# Altium schematic sheet sys-part2.SchDoc
size A3; SheetNumber: 2; SheetTotal: 2
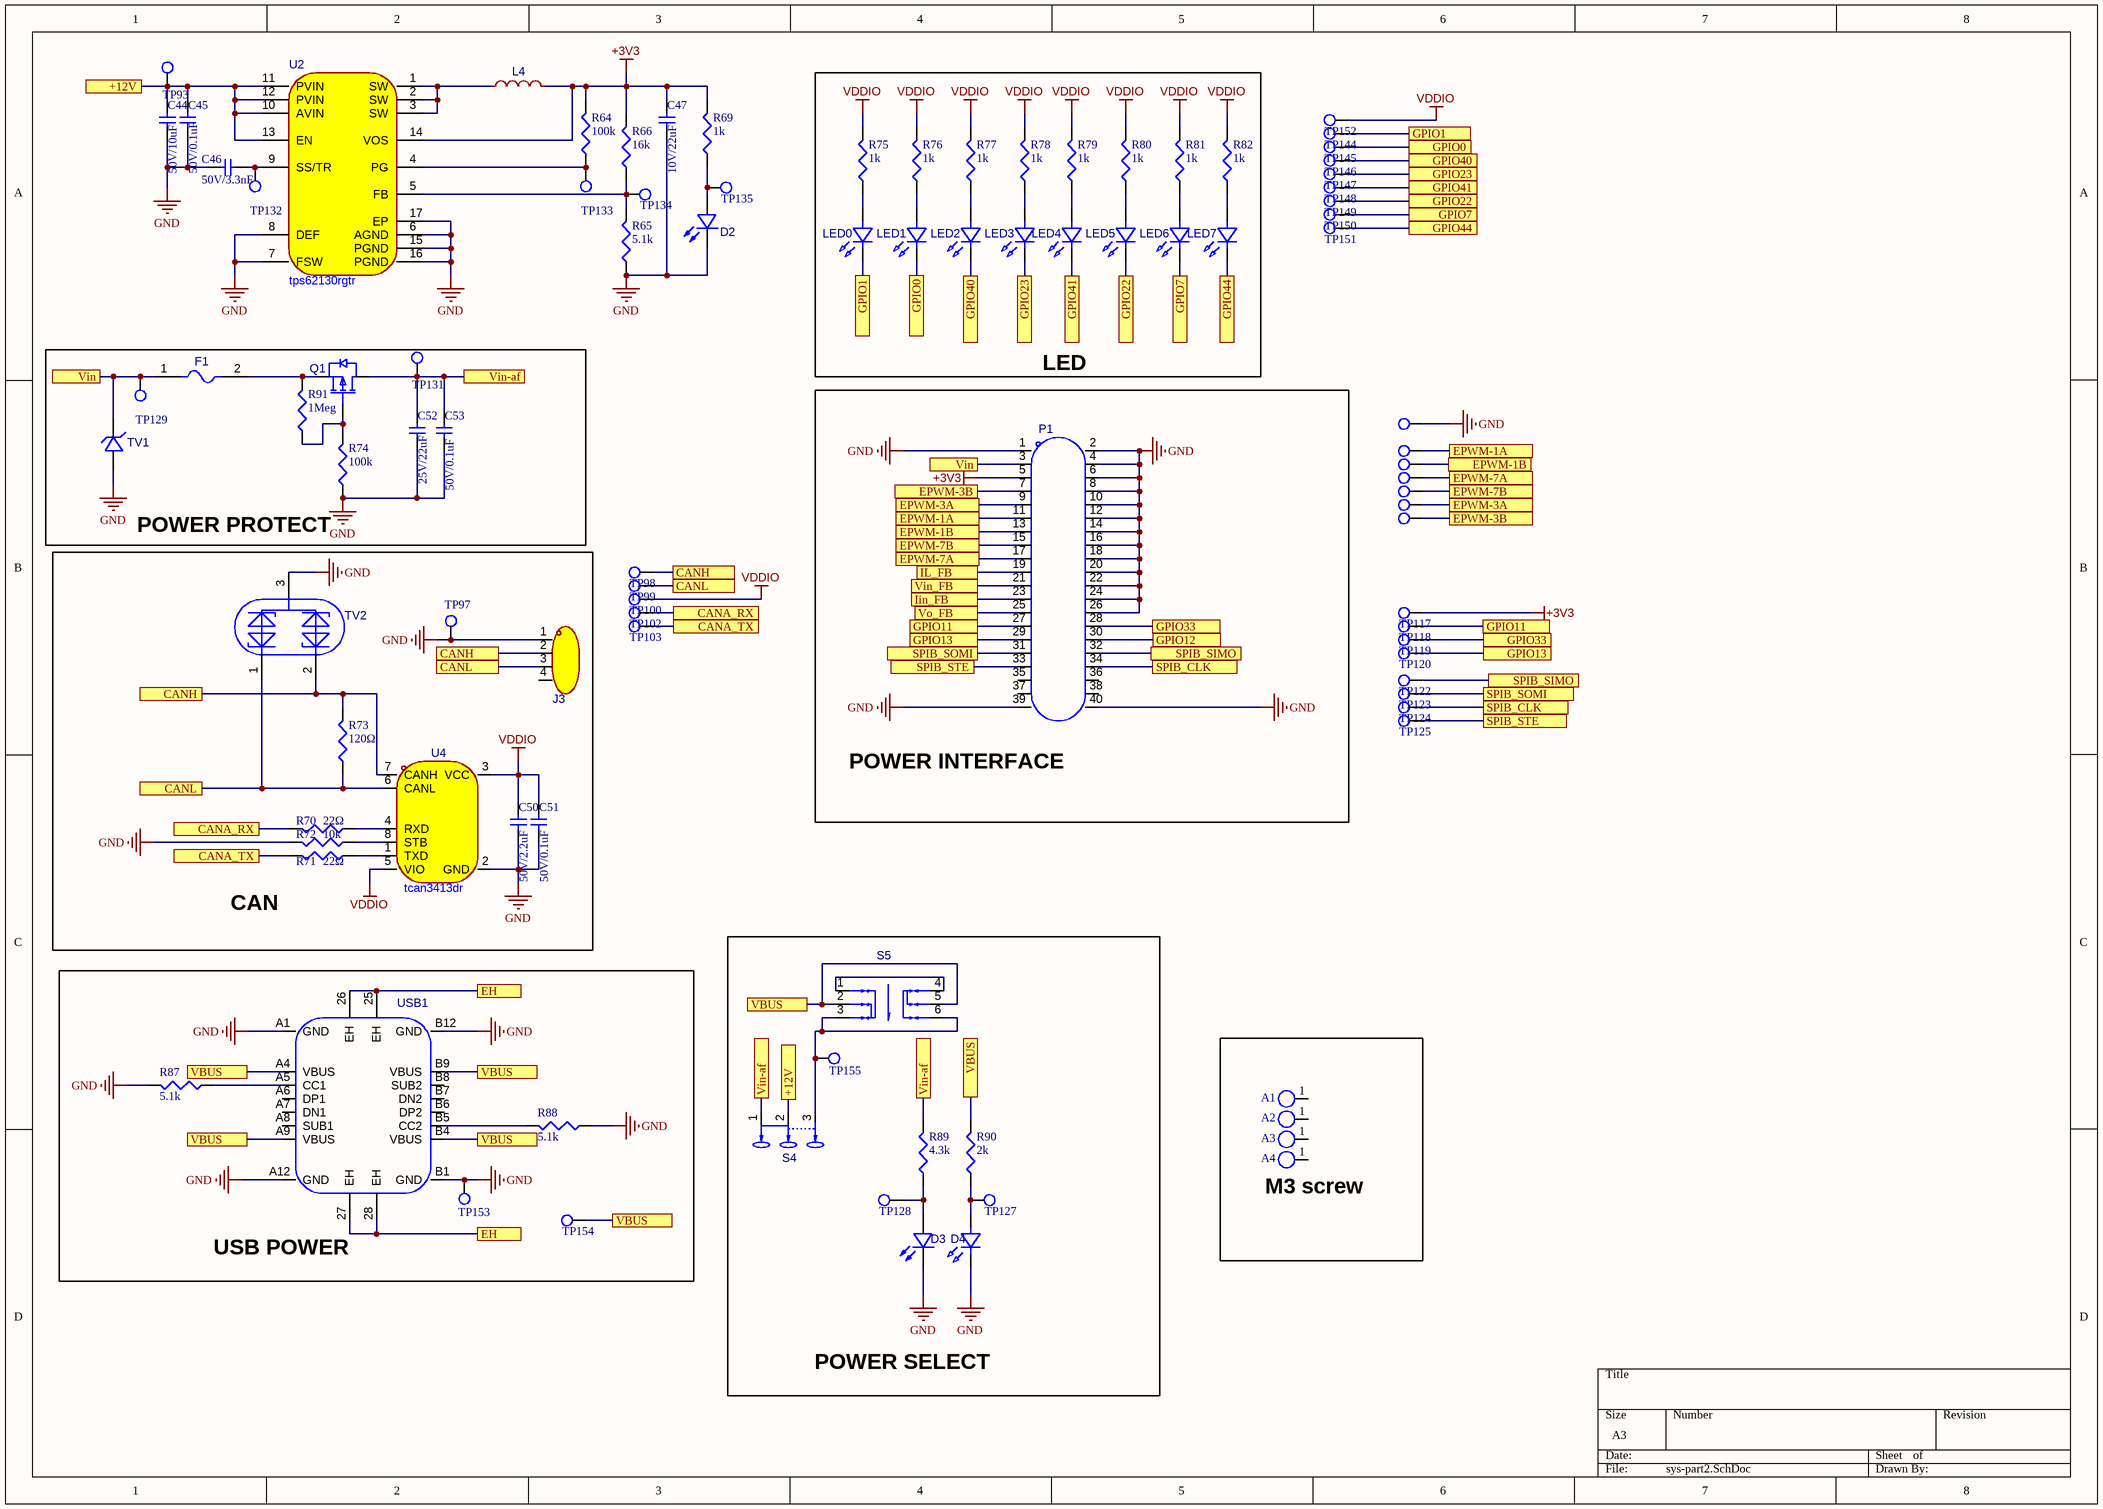
[diagram p0: sys-part2.SchDoc]

## Parts
A1  PAD-3.2/6.0  [PAD-3.2/6.0]  (value not drawn)
A2  PAD-3.2/6.0  [PAD-3.2/6.0]  (value not drawn)
A3  PAD-3.2/6.0  [PAD-3.2/6.0]  (value not drawn)
A4  PAD-3.2/6.0  [PAD-3.2/6.0]  (value not drawn)
C44  50V/10uF  [C0805]
C45  50V/0.1uF  [C0603]
C46  50V/3.3nF  [C0603]
C47  10V/22uF  [C0603]
C50  50V/2.2uF  [C0805]
C51  50V/0.1uF  [C0603]
C52  25V/22uF  [C0805]
C53  50V/0.1uF  [C0603]
D2  ncd0805c1  [LED0805-RD]  (value not drawn)
D3  ncd0805c1  [LED0805-RD]  (value not drawn)
D4  xl-2012surc  [LED0805-RD_RED]  (value not drawn)
F1  nsmd050-24v  [F1206]  (value not drawn)
J3  db125-3.81-4p-gn-s  [CONN-TH_DB125-3.81-4P]  (value not drawn)
L4  fhd4020s-3r3mt  [IND-SMD_L4.0-W4.0]  (value not drawn)
LED0  xl-2012surc  [LED0805-RD_RED]  (value not drawn)
LED1  xl-2012surc  [LED0805-RD_RED]  (value not drawn)
LED2  xl-2012surc  [LED0805-RD_RED]  (value not drawn)
LED3  xl-2012surc  [LED0805-RD_RED]  (value not drawn)
LED4  xl-2012surc  [LED0805-RD_RED]  (value not drawn)
LED5  xl-2012surc  [LED0805-RD_RED]  (value not drawn)
LED6  xl-2012surc  [LED0805-RD_RED]  (value not drawn)
LED7  xl-2012surc  [LED0805-RD_RED]  (value not drawn)
P1  zx-pm2.54-2-20py  [HDR-TH_40P-P2.54-V-F-R2-C20-S2.54]  (value not drawn)
Q1  ao3407a_c15155  [SOT-23-3_L2.9-W1.6-P1.90-LS2.8-BR]  (value not drawn)
R64  100k  [R0603]
R65  5.1k  [R0603]
R66  16k  [R0603]
R69  1k  [R0603]
R70  22Ω  [R0603]
R71  22Ω  [R0603]
R72  10k  [R0603]
R73  120Ω  [R0603]
R74  100k  [R0603]
R75  1k  [R0603]
R76  1k  [R0603]
R77  1k  [R0603]
R78  1k  [R0603]
R79  1k  [R0603]
R80  1k  [R0603]
R81  1k  [R0603]
R82  1k  [R0603]
R87  5.1k  [R0603]
R88  5.1k  [R0603]
R89  4.3k  [R0603]
R90  2k  [R0603]
R91  1Meg  [R0603]
S4  ss-12d10l5  [SW-TH_SS-12D10L5]  (value not drawn)
S5  xkb8080-z  [SW-TH_6P-L8.0-W8.0-P2.50]  (value not drawn)
TP93  TEST POINT  [TP-1.5]  (value not drawn)
TP97  TP-pad0.8  [PAD0.8/1.6]  (value not drawn)
TP98  TEST POINT  [TP-1.5]  (value not drawn)
TP99  TEST POINT  [TP-1.5]  (value not drawn)
TP100  TEST POINT  [TP-1.5]  (value not drawn)
TP102  TEST POINT  [TP-1.5]  (value not drawn)
TP103  TEST POINT  [TP-1.5]  (value not drawn)
TP104  TP-pad0.8  [PAD0.8/1.6]  (value not drawn)
TP105  TP-pad0.8  [PAD0.8/1.6]  (value not drawn)
TP106  TP-pad0.8  [PAD0.8/1.6]  (value not drawn)
TP107  TP-pad0.8  [PAD0.8/1.6]  (value not drawn)
TP108  TP-pad0.8  [PAD0.8/1.6]  (value not drawn)
TP109  TP-pad0.8  [PAD0.8/1.6]  (value not drawn)
TP110  TP-pad0.8  [PAD0.8/1.6]  (value not drawn)
TP117  TEST POINT  [TP-1.5]  (value not drawn)
TP118  TEST POINT  [TP-1.5]  (value not drawn)
TP119  TEST POINT  [TP-1.5]  (value not drawn)
TP120  TEST POINT  [TP-1.5]  (value not drawn)
TP122  TEST POINT  [TP-1.5]  (value not drawn)
TP123  TEST POINT  [TP-1.5]  (value not drawn)
TP124  TEST POINT  [TP-1.5]  (value not drawn)
TP125  TEST POINT  [TP-1.5]  (value not drawn)
TP127  TEST POINT  [TP-1.5]  (value not drawn)
TP128  TEST POINT  [TP-1.5]  (value not drawn)
TP129  TEST POINT  [TP-1.5]  (value not drawn)
TP131  TEST POINT  [TP-1.5]  (value not drawn)
TP132  TEST POINT  [TP-1.5]  (value not drawn)
TP133  TEST POINT  [TP-1.5]  (value not drawn)
TP134  TEST POINT  [TP-1.5]  (value not drawn)
TP135  TEST POINT  [TP-1.5]  (value not drawn)
TP144  TEST POINT  [TP-1.5]  (value not drawn)
TP145  TEST POINT  [TP-1.5]  (value not drawn)
TP146  TEST POINT  [TP-1.5]  (value not drawn)
TP147  TEST POINT  [TP-1.5]  (value not drawn)
TP148  TEST POINT  [TP-1.5]  (value not drawn)
TP149  TEST POINT  [TP-1.5]  (value not drawn)
TP150  TEST POINT  [TP-1.5]  (value not drawn)
TP151  TEST POINT  [TP-1.5]  (value not drawn)
TP152  TEST POINT  [TP-1.5]  (value not drawn)
TP153  TP-pad0.8  [PAD0.8/1.6]  (value not drawn)
TP154  TEST POINT  [TP-1.5]  (value not drawn)
TP155  TP-pad0.8  [PAD0.8/1.6]  (value not drawn)
TV1  smbj15a_c83846  [SMB_L4.6-W3.6-LS5.3-RD]  (value not drawn)
TV2  pesd1can,215  [SOT-23_L2.9-W1.3-P1.90-LS2.4-BR]  (value not drawn)
U2  tps62130rgtr  [QFN-16_L3.0-W3.0-P0.50-TL-EP1.7]
U4  tcan3413dr  [SOP-8_L4.9-W3.9-P1.27-LS6.0-BL-1]
USB1  type-c 16p cb1.6 073  [USB-C-SMD_SHOU_TYPE-C-16P-CB1.6]  (value not drawn)

## Blocks framed on the sheet
LED: LED0-LED7 R75-R82
POWER PROTECT: C52 C53 F1 Q1 R74 R91 TP129 TP131 TV1
POWER INTERFACE: P1
CAN: C50 C51 J3 R70-R73 TP97 TV2 U4
USB POWER: R87 R88 TP153 TP154 USB1
POWER SELECT: D3 D4 R89 R90 S4 S5 TP127 TP128 TP155
M3 screw: A1-A4

## Ports
+12V, CANA_RX, CANA_TX, CANH, CANL, EH, EPWM-1A, EPWM-1B, EPWM-3A, EPWM-3B, EPWM-7A, EPWM-7B, GPIO0, GPIO1, GPIO7, GPIO11, GPIO12, GPIO13, GPIO22, GPIO23, GPIO33, GPIO40, GPIO41, GPIO44, Iin_FB, IL_FB, SPIB_CLK, SPIB_SIMO, SPIB_SOMI, SPIB_STE, VBUS, Vin, Vin-af, Vin_FB, Vo_FB

## Nets
+3V3: C47.1 L4.2 P1.5 R64.2 R66.2 R69.2 TP117.1 U2.14(VOS)
GND: C44.2 C45.2 C46.1 C47.2 C50.2 C51.2 C52.2 C53.2 D2.1(K) D3.1(K) D4.1(K) J3.1 P1.1 P1.2 P1.4 P1.6 P1.8 P1.10 P1.12 P1.14 P1.16 P1.18 P1.20 P1.22 P1.24 P1.26 P1.39 P1.40 R65.1 R72.2 R74.1 R87.2 R88.1 TP97.1 TP104.1 TP153.1 TV1.2 TV2.3 U2.6(AGND) U2.7(FSW) U2.8(DEF) U2.15(PGND) U2.16(PGND) U2.17(EP) U4.2(GND) USB1.A1(GND) USB1.A12(GND) USB1.B1(GND) USB1.B12(GND)
VDDIO: C50.1 C51.1 R75.2 R76.2 R77.2 R78.2 R79.2 R80.2 R81.2 R82.2 TP100.1 TP152.1 U4.3(VCC) U4.5(VIO)
+12V: C44.1 C45.1 S4.2 TP93.1 U2.10(AVIN) U2.11(PVIN) U2.12(PVIN) U2.13(EN) ; port +12V
CANA_RX: R70.2 TP102.1 ; port CANA_RX
CANA_TX: R71.2 TP103.1 ; port CANA_TX
CANH: J3.2 R73.2 TP98.1 TV2.2 U4.7(CANH) ; port CANH
CANL: J3.3 R73.1 TP99.1 TV2.1 U4.6(CANL) ; port CANL
EH: USB1.25(EH) USB1.26(EH) USB1.27(EH) USB1.28(EH) ; port EH
EPWM-1A: P1.11 TP105.1 ; port EPWM-1A
EPWM-1B: P1.13 TP106.1 ; port EPWM-1B
EPWM-3A: P1.9 TP109.1 ; port EPWM-3A
EPWM-3B: P1.7 TP110.1 ; port EPWM-3B
EPWM-7A: P1.17 TP107.1 ; port EPWM-7A
EPWM-7B: P1.15 TP108.1 ; port EPWM-7B
GPIO0: LED1.1(K) TP145.1 ; port GPIO0
GPIO1: LED0.1(K) TP144.1 ; port GPIO1
GPIO7: LED6.1(K) TP150.1 ; port GPIO7
GPIO11: P1.27 TP118.1 ; port GPIO11
GPIO12: P1.30 ; port GPIO12
GPIO13: P1.29 TP120.1 ; port GPIO13
GPIO22: LED5.1(K) TP149.1 ; port GPIO22
GPIO23: LED3.1(K) TP147.1 ; port GPIO23
GPIO33: P1.28 TP119.1 ; port GPIO33
GPIO40: LED2.1(K) TP146.1 ; port GPIO40
GPIO41: LED4.1(K) TP148.1 ; port GPIO41
GPIO44: LED7.1(K) TP151.1 ; port GPIO44
Iin_FB: P1.23 ; port Iin_FB
IL_FB: P1.19 ; port IL_FB
SPIB_CLK: P1.34 TP124.1 ; port SPIB_CLK
SPIB_SIMO: P1.32 TP122.1 ; port SPIB_SIMO
SPIB_SOMI: P1.31 TP123.1 ; port SPIB_SOMI
SPIB_STE: P1.33 TP125.1 ; port SPIB_STE
VBUS: R90.2 S5.2 S5.5 TP154.1 USB1.A4(VBUS) USB1.A9(VBUS) USB1.B4(VBUS) USB1.B9(VBUS) ; port VBUS
Vin: F1.1 P1.3 TP129.1 TV1.1 ; port Vin
Vin-af: C52.1 C53.1 Q1.3(D) R89.2 S4.1 TP131.1 ; port Vin-af
Vin_FB: P1.21 ; port Vin_FB
Vo_FB: P1.25 ; port Vo_FB
NetC46_2: C46.2 TP132.1 U2.9(SS/TR)
NetD2_2: D2.2(A) R69.1 TP135.1
NetD3_2: D3.2(A) R89.1 TP128.1
NetD4_2: D4.2(A) R90.1 TP127.1
NetF1_2: F1.2 Q1.2(S) R91.2
NetL4_1: L4.1 U2.1(SW) U2.2(SW) U2.3(SW)
NetLED0_2: LED0.2(A) R75.1
NetLED1_2: LED1.2(A) R76.1
NetLED2_2: LED2.2(A) R77.1
NetLED3_2: LED3.2(A) R78.1
NetLED4_2: LED4.2(A) R79.1
NetLED5_2: LED5.2(A) R80.1
NetLED6_2: LED6.2(A) R81.1
NetLED7_2: LED7.2(A) R82.1
NetQ1_1: Q1.1(G) R74.2 R91.1
NetR64_1: R64.1 TP133.1 U2.4(PG)
NetR65_2: R65.2 R66.1 TP134.1 U2.5(FB)
NetR70_1: R70.1 U4.4(RXD)
NetR71_1: R71.1 U4.1(TXD)
NetR72_1: R72.1 U4.8(STB)
NetR87_1: R87.1 USB1.A5(CC1)
NetR88_2: R88.2 USB1.B5(CC2)
NetS4_3: S4.3 S5.3 S5.6 TP155.1
NetS5_1: S5.1 S5.4

Not connected (* = marked no-connect by the designer): A1 1; A2 1; A3 1; A4 1; J3 4; P1 35 36 37 38; USB1 A6(DP1) A7(DN1) A8(SUB1) B6(DP2) B7(DN2) B8(SUB2)

## Library data of the parts
C44 = C0805-50V/10uF: 0805,50V/10uF,
C45 C51 C53 = C0603-50V/104: 0603,50V/104
C46 = C0603-50V/3.3nF: 0603,50V/3.3nF
C47 = C0603-10V/22uF: 0603,10V/22uF
C50 = C0805-50V/2.2uF: 0805,50V/2.2uF,
C52 = C0805-25V/22uF: 0805,25V/22uF,
D2 D3 = ncd0805c1: 灯头类型:-;发光颜色:黄绿色;正向压降(Vf):1.6V~2.6V;功率:65mW;正向电流:25mA;波长:565nm~578nm;二极管配置:独立二极管;透镜颜色:-;色温:-;发光强度:55mcd;发光角度:130°;载带方式:-;工作温度:-30℃~+85℃;; Manufacturer: 国星光电; Symbol: FC-2012GHK-570A08; AddInBom: yes; ModelId: b1c5ed7a4f6e46d3bc6f6cc7c20f3fea; ModelTransform: 79.527,49.2125,0,0,0,0,0,0,0; Illumination Color: 黄绿色; Power(Watts): 65mW; Forward Current: 25mA; Peak Wavelength: 576nm; Diode Configuration: 独立二极管; Luminous Intensity: 55mcd; Viewing Angle: 130°; LCSC Part Name: 片式发光二极管; SupplierPart: C84257; ManufacturerPart: NCD0805C1; Supplier Footprint: 0805; JLCPCB Part Class: Extended Part; Datasheet: https://item.szlcsc.com/datasheet/NCD0805C1/85426.html; Supplier: LCSC; ConvertToPcb: yes; FootprintName: LED0805-RD; ModelName: LED0805-RD; Lamp Holder Type: -; Voltage - Forward(Vf): 1.6V~2.6V; Wavelength - Dominant: 565nm~578nm; Lens Color: -; Color Temperature: -; Mounting Style: -; Operating Temperature: -30℃~+85℃
D4 LED0-LED7 = xl-2012surc: 灯头类型:2mmx1.2mm方形灯头;发光颜色:红色;正向压降(Vf):2.3V;功率:50mW;正向电流:20mA;波长:615nm~630nm;二极管配置:独立二极管;透镜颜色:无色透明透镜;色温:-;发光强度:230mcd;发光角度:120°;载带方式:正贴;工作温度:-40℃~+85℃;; Manufacturer: XINGLIGHT(成兴光); AddInBom: yes; ModelId: 9e1095fac56a47ba900124c2261595bd; ModelTransform: 79.527,49.2125,0,0,0,0,0,-0.004,0; Illumination Color: 红色; Voltage - Forward(Vf): 2.3V; Power(Watts): 50mW; Forward Current: 20mA; Peak Wavelength: 620nm; Diode Configuration: 独立二极管; Lens Color: 无色透明透镜; Luminous Intensity: 230mcd; Viewing Angle: 120°; Symbol: XL-2012SURC; LCSC Part Name: 0805红贴片式发光二极管; SupplierPart: C965812; ManufacturerPart: XL-2012SURC; Supplier Footprint: 0805; JLCPCB Part Class: Extended Part; Datasheet: https://item.szlcsc.com/datasheet/XL-2012SURC/1051421.html; Supplier: LCSC; ConvertToPcb: yes; FootprintName: LED0805-RD_RED; ModelName: LED0805-RD_RED; Lamp Holder Type: 2mmx1.2mm方形灯头; Wavelength - Dominant: 615nm~630nm; Color Temperature: -; Mounting Style: 正贴; Operating Temperature: -40℃~+85℃
F1 = nsmd050-24v: 耐压(Vmax):24V;最大电流(Imax):100A;保持电流(Ihold):500mA;跳闸电流(Itrip):1A;; Manufacturer: 台湾陆海; AddInBom: yes; ModelId: f1628daad26847a79b887277a2bc8541; ModelName: F1206_L3.2-W1.7-H0.6; ModelTransform: 125.984,66.929,0,0,0,0,0,0,0; Voltage - Max: 24V; Current - Max: 100A; Hold Current: 500mA; Trip Current: 1A; Power Dissipation: 600mW; Resistance - Initial (Ri) (Min): 150mΩ; Resistance - Post Trip (R1) (Max): 700mΩ; Time to Trip(Max): 100ms; Symbol: nSMD050-24V; LCSC Part Name: 0.50A  24V 自恢复保险丝; SupplierPart: C70076; ManufacturerPart: nSMD050-24V; Supplier Footprint: 1206; JLCPCB Part Class: Extended Part; Datasheet: https://item.szlcsc.com/datasheet/nSMD050-24V/71171.html; Supplier: LCSC; ConvertToPcb: yes; FootprintName: F1206; Length: 3.5mm; Width: 1.8mm; Height: 1.4mm
J3 = db125-3.81-4p-gn-s: 结构:1x4P;间距:3.81mm;颜色:绿色;安装方式:直插;排数:1;每排PIN数:4;额定电流:10A;额定电压:300V;线规 - AWG:16~26;线规 - 平方毫米:1;工作温度:-40℃~+105℃;; Manufacturer: DORABO(地博电气); AddInBom: yes; ModelId: 11e8572fb837469c9a45098d5493725c; ModelName: CONN-TH_DB3.81-LI-4P-125; ModelTransform: 619.6736,291.338,0,180,0,0,11.811,-7.874,-157.48; Number of Positions or Pins: 1x4P; Pitch: 3.81mm; Number of PINs Per Row: 4; Screw Specification: M2; Current Rating: 10A; Voltage Rating (Max): 300V; Wire Gauge - AWG: 16~26; Wire Gauge - mm2: 1; Symbol: DB125-3.81-4P; LCSC Part Name: 1x4P 3.81mm 直插 排数:1 每排P数:4; SupplierPart: C395880; ManufacturerPart: DB125-3.81-4P-GN-S; Supplier Footprint: 插件,P=3.81mm; JLCPCB Part Class: Extended Part; Datasheet: https://item.szlcsc.com/datasheet/DB125-3.81-4P-GN-S/376627.html; Supplier: LCSC; ConvertToPcb: yes; FootprintName: CONN-TH_DB125-3.81-4P; Color: 绿色; Mounting Type: 直插; Number of Pins: 4P; Number of Rows: 1; Operating Temperature: -40℃~+105℃
L4 = fhd4020s-3r3mt: 电感值:3.3uH;精度:±20%;额定电流:4A;饱和电流(Isat):5.9A;类型:绕线电感;; Manufacturer: cjiang(长江微电); AddInBom: yes; ModelId: 45bc3737ecfd4f3bb122605ee525b018; ModelName: IND-SMD_L4.0-W4.0-H1.9; ModelTransform: 157.48,157.484,0,0,0,0,0,0,0; Value: 3.3uH; Tolerance: ±20%; Current Rating: 4A; Current - Saturation(Isat): 5.9A; DC Resistance(DCR): 73mΩ; Type: 绕线电感; Symbol: FHD4020S-3R3MT; LCSC Part Name: 3.3uH ±20% 5.9A; SupplierPart: C602030; ManufacturerPart: FHD4020S-3R3MT; Supplier Footprint: SMD,4x4mm; JLCPCB Part Class: Extended Part; Datasheet: https://atta.szlcsc.com/upload/public/pdf/source/20200609/C601990_BCEA243EC4DA0A9A288AA78A6DFB48A5.pdf; Supplier: LCSC; ConvertToPcb: yes; FootprintName: IND-SMD_L4.0-W4.0
P1 = zx-pm2.54-2-20py: 插孔结构:2x20P;间距:2.54mm;行距:2.54mm;圆孔/方孔:方孔;安装方式:直插;排数:双排;总孔位数:40P;额定电流:3A;额定电压:-;插孔方向:顶部;塑高:8.5mm;触头材质:黄铜;触头镀层:金;工作温度:-40℃~+105℃;; Manufacturer: Megastar(兆星); AddInBom: yes; ModelId: 6c85b3860eb24e43a9d123684eb6d3ee; ModelName: HDR-TH_40P-P2.54-F-LI-2X20P; ModelTransform: 2015.783,196.85,0,0,0,0,0,0,-125.984; Holes Structure: 2x20P; Pitch: 2.54mm; Circular Hole / Square Hole: 方孔; Number of Positions: 40P; Current Rating: 3A; Holes Direction: 顶部; PIN Length: 3.2mm; Symbol: ZX-PM2.54-2-20PY; LCSC Part Name: 2x20P 间距:2.54mm 直插; SupplierPart: C7499354; ManufacturerPart: ZX-PM2.54-2-20PY; Supplier Footprint: 插件,P=2.54mm; JLCPCB Part Class: Extended Part; Datasheet: https://item.szlcsc.com/datasheet/ZX-PM2.54-2-20PY/8574015.html; Supplier: LCSC; ConvertToPcb: yes; FootprintName: HDR-TH_40P-P2.54-V-F-R2-C20-S2.54; Row Spacing: 2.54mm; Mounting Type: 直插; Number of Rows: 双排; Voltage Rating (Max): -; Insulation Height: 8.5mm; Contact Material: 黄铜; Contact Plating: 金; Operating Temperature: -40℃~+105℃
Q1 = ao3407a_c15155: 数量:1个P沟道;漏源电压(Vdss):30V;连续漏极电流(Id):4.3A;导通电阻(RDS(on)):48mΩ@10V;耗散功率(Pd):-;阈值电压(Vgs(th)):2.5V@250uA;; Manufacturer: AOS; AddInBom: yes; ModelId: 89cb27a44ab2466697082bb9fd73a7d0; ModelName: SOT-23-3L_L2.9-W1.6-H1.1-LS2.8-P0.95; ModelTransform: 114.173,110.236,0,90,0,0,0,0,0; Number: 1个P沟道; Drain to Source Voltage: 30V; Current - Continuous Drain(Id): 4.3A; Gate Charge(Qg): 16nC@10V; Input Capacitance(Ciss): 830pF; Reverse Transfer Capacitance (Crss@Vds): 92pF@15V; Symbol: AO3407A; LCSC Part Name: 1个P沟道 耐压:30V 电流:4.3A; SupplierPart: C15155; ManufacturerPart: AO3407A; Supplier Footprint: SOT-23; JLCPCB Part Class: Extended Part; Datasheet: https://item.szlcsc.com/datasheet/AO3407A/15829.html; Supplier: LCSC; ConvertToPcb: yes; FootprintName: SOT-23-3_L2.9-W1.6-P1.90-LS2.8-BR; RDS(on): 48mΩ@10V; Pd - Power Dissipation: -; Gate Threshold Voltage (Vgs(th)): 2.5V@250uA; Operating Temperature: -; Configuration: -; Type: -; Output Capacitance(Coss): -
R64 R74 = R0603-100k: 0603,100k
R65 R87 R88 = R0603-5.1k: 0603,5.1k
R66 = R0603-16k: 0603,16k
R69 R75-R82 = R0603-1k: 0603,1k
R70 R71 = R0603-22Ω: 0603,22Ω
R72 = R0603-10k: 0603,10k
R73 = R0603-120Ω: 0603,120Ω
R89 = R0603-4.3k: 0603,4.3k
R90 = R0603-2k: 0603,2k
R91 = R0603-1Meg: 0603,1Meg
S4 = ss-12d10l5: 电路结构:单刀双掷;安装方式:直插;开关颜色:黑色;额定电流:3A;额定电压:125V;工作寿命:1万次;; Manufacturer: XKB Connection(中国星坤); AddInBom: yes; ModelId: c49f07a32c154ec8ad7cf47670a53981; ModelName: SW-TH_L13.0-W6.8-H6.4-P4.7; ModelTransform: 511.81394,267.716,0,0,0,0,0,0,-220.472; Circuit: 单刀双掷; Actuator Style: 矩形柱状; Switch Height: 6.4mm; Actuator Color: 黑色; Current Rating: 3A; Voltage Rating: 125V; Life: 1万次; Symbol: SS-12D10L5; LCSC Part Name: 柄长5mm 直插双档 滑动开关; SupplierPart: C319012; ManufacturerPart: SS-12D10L5; Supplier Footprint: 插件,13x6.8mm; JLCPCB Part Class: Extended Part; Datasheet: https://item.szlcsc.com/datasheet/SS-12D10L5/300104.html; Supplier: LCSC; ConvertToPcb: yes; FootprintName: SW-TH_SS-12D10L5; Termination Style: PC引脚; Length: 13mm; Width: 6.8mm; Mounting Type: 直插; Operating Temperature: -40℃~+85℃
S5 = xkb8080-z: 自锁/无锁:自锁;安装方式:直插;触点电流:100mA;额定电压:30V;带灯:不带;作用力:1.6N;工作寿命:10万次;; Manufacturer: XKB Connection(中国星坤); AddInBom: yes; ModelId: 2ca63b555ed647238a13c4f5c2920312; ModelName: SW-TH_L8.0-W8.0-H13.7-P2.5; ModelTransform: 314.96,314.96,0,90,0,0,0,0,-125.984; Self Lock / No Lock: 自锁; Actuator Style: 矩形按钮; Contact Current: 100mA; Voltage Rating: 30V; Actuator/Cap Color: 蓝色; With Lamp: 不带; Operating Force: 1.6N; Life: 10万次; Symbol: XKB8080-Z; LCSC Part Name: 8*8 蓝白黑 自锁开关; SupplierPart: C318860; ManufacturerPart: XKB8080-Z; Supplier Footprint: 插件; JLCPCB Part Class: Extended Part; Datasheet: https://item.szlcsc.com/datasheet/XKB8080-Z/299952.html; Supplier: LCSC; ConvertToPcb: yes; FootprintName: SW-TH_6P-L8.0-W8.0-P2.50; IP Rating: -; Mounting Type: 直插; Termination Style: PC引脚; Operating Temperature: -15℃~+55℃
TV1 = smbj15a_c83846: 极性:单向;反向截止电压(Vrwm):15V;钳位电压:24.4V;峰值脉冲电流(Ipp):24.6A;峰值脉冲功率(Ppp):600W;击穿电压(VBR):16.7V;; Manufacturer: Littelfuse(美国力特); AddInBom: yes; ModelId: 5e8926c661484ff2a35b83e5ae62aeb9; ModelTransform: 212.598,141.732,0,0,0,0,0,0,0; Polarity: 单向; Reverse Stand-Off Voltage (Vrwm): 15V; Clamping Voltage: 24.4V; Peak Pulse Current (Ipp): 24.6A; Peak Pulse Power Dissipation (Ppp): 600W; Voltage - Breakdown: 16.7V; Reverse Leakage Current (Ir): 1uA; level of protection: IEC 61000-4-4；IEC 61000-4-2; Symbol: SMBJ15A_C83846; LCSC Part Name: 单向TVS 15V截止 峰值浪涌电流：24.6A; SupplierPart: C83846; ManufacturerPart: SMBJ15A; Supplier Footprint: DO-214AA; JLCPCB Part Class: Extended Part; Datasheet: https://item.szlcsc.com/datasheet/SMBJ15A/85013.html; Supplier: LCSC; ConvertToPcb: yes; FootprintName: SMB_L4.6-W3.6-LS5.3-RD; ModelName: SMB_L4.6-W3.6-LS5.3-RD; Operating Temperature: -65℃~+150℃; Type: TVS
TV2 = pesd1can,215: 极性:双向;反向截止电压(Vrwm):24V;钳位电压:70V;峰值脉冲电流(Ipp):3A@8/20us;峰值脉冲功率(Ppp):200W@8/20us;击穿电压(VBR):27.8V;; Manufacturer: Nexperia(安世); AddInBom: yes; ModelId: c62791f0466c4ae2a892c056b845b0ca; ModelName: SOT-23-3P_L2.9-W1.3-H1.0-LS2.4-P0.95; ModelTransform: 98.64468,114.173,0,180,0,0,0.001,-0.002,0; Polarity: 双向; Reverse Stand-Off Voltage (Vrwm): 24V; Clamping Voltage: 70V; Voltage - Breakdown: 27.8V; Reverse Leakage Current (Ir): 1nA; Number of Channels: 双路; level of protection: IEC 61000-4-5；IEC 61000-4-2; Junction Capacitance: 11pF; Symbol: PESD1CAN,215; LCSC Part Name: 双向ESD 24V截止 峰值脉冲电流：3A@8/20us; SupplierPart: C15771; ManufacturerPart: PESD1CAN,215; Supplier Footprint: SOT-23; JLCPCB Part Class: Extended Part; Datasheet: https://item.szlcsc.com/datasheet/PESD1CAN%252C215/16453.html; Supplier: LCSC; ConvertToPcb: yes; FootprintName: SOT-23_L2.9-W1.3-P1.90-LS2.4-BR; Peak Pulse Current (Ipp): 3A@8/20us; Peak Pulse Power Dissipation (Ppp): 200W@8/20us; Operating Temperature: -65℃~+150℃; Type: ESD
U2 = tps62130rgtr: 功能类型:降压型;工作电压:3V~17V;输出电压:900mV~6V;输出电流:3A;输出类型:可调;; Manufacturer: TI(德州仪器); AddInBom: yes; ModelId: 4b11d3b5aea64910b85c54184b64922e; ModelName: QFN-16_L3.0-W3.0-P0.50-EP1.7; ModelTransform: 118.8974,118.8974,0,0,0,0,0,0,0; Function: 降压型; Voltage - Supply: 3V~17V; Output Current: 3A; Frequency - Switching: 2.5MHz; Synchronous Rectifier: 是; Number of Outputs: 1; Topology: 降压式; Quiescent Current: 17uA; Switch tube (built-in/external): 内置; Output Type: 可调; Symbol: TPS62130RGTR; LCSC Part Name: 降压型 3A 3V~17V; SupplierPart: C43590; ManufacturerPart: TPS62130RGTR; Supplier Footprint: QFN-16-EP(3x3); JLCPCB Part Class: Extended Part; Datasheet: https://www.ti.com/cn/lit/ds/symlink/tps62130.pdf; Supplier: LCSC; ConvertToPcb: yes; FootprintName: QFN-16_L3.0-W3.0-P0.50-TL-EP1.7; Output Voltage: 900mV~6V; Operating Temperature: -40℃~+85℃@(TA); Features: 轻载高效模式；可调软启动；过流保护；输出电压跟随；工作状态指示
U4 = tcan3413dr: 类型:CAN-FD收发器;数据速率:5Mbps;; Manufacturer: TI(德州仪器); AddInBom: yes; ModelId: 75c24a7891ee4dd6bdac16a7163ff87e; ModelTransform: 192.913,236.22,0,0,0,0,0,0,0; Data Rate: 5Mbps; Voltage - Supply: 3V~3.6V; Current - Supply: 42mA; Supply Current (Iq): 4uA; Symbol: TCAN3413DR; LCSC Part Name: TCAN3413 3.3-V CAN FD 收发器; SupplierPart: C22433320; ManufacturerPart: TCAN3413DR; Supplier Footprint: SOIC-8; JLCPCB Part Class: Extended Part; Datasheet: https://www.ti.com.cn/cn/lit/ds/symlink/tcan3413.pdf?ts=1739433172079&ref_url=https%253A%252F%252Fwww.ti.com.cn%252Fsitesearch%252Fzh-cn%252Fdocs%252Funiversalsearch.tsp%253FlangPref%253Dzh-CN%2526nr%253D19%2526searchTerm%253DTCAN3413DR; Supplier: LCSC; ConvertToPcb: yes; FootprintName: SOP-8_L4.9-W3.9-P1.27-LS6.0-BL-1; ModelName: SOP-8_L4.9-W3.9-P1.27-LS6.0-BL-1; Type: CAN-FD收发器; Operating Temperature: -40℃~+125℃
USB1 = type-c 16p cb1.6 073: 连接器类型:Type-C;协议标准:USB 3.1;公母:母;安装方式:沉板;触点数量:16P;端口数量:1;额定电流 - 电源:3A;工作温度:-25℃~+85℃;; Manufacturer: SHOU HAN(首韩); AddInBom: yes; ModelId: 26f34bb6c6bf4f1dbd42510d10f41fd6; ModelTransform: 454.33,283.464,0,0,0,0,0,-42.322,-62.992; Protocol Standard: USB 3.1; Gender: 母; Number of Ports: 1; Current Rating-Power: 3A; Voltage Rating: 5V; Connect-Disconnect Life: 5千次; Detection color: 黑色; Symbol: TYPE-C 16P CB1.6 073; LCSC Part Name: 16P沉板母座; SupplierPart: C2906290; ManufacturerPart: TYPE-C 16P CB1.6 073; Supplier Footprint: SMD; JLCPCB Part Class: Extended Part; Datasheet: https://item.szlcsc.com/datasheet/TYPE-C%252016P%2520CB1.6%2520073/3179000.html; Supplier: LCSC; ConvertToPcb: yes; FootprintName: USB-C-SMD_SHOU_TYPE-C-16P-CB1.6; ModelName: USB-C-SMD_SHOU_TYPE-C-16P-CB1.6; Connector Type: Type-C; Mounting Type: 沉板; Number of Contacts: 16P; Operating Temperature: -25℃~+85℃